# Altium schematic sheet SAMC21N_Xplained_Pro_EDBG.SchDoc: Embedded Debugger (EDBG)
size A3; Organization: Microchip India; DocumentNumber: A09-2682; Revision: 4; SheetNumber: 5; SheetTotal: 9; CheckedBy: M.S.K; DrawnBy: Microchip India; PageSetup: Record=PageOptions|CenterHorizontal=True|CenterVertical=True|PrintScale=0.71|XCorrection=1.00|YCorrection=1.00|PrintKind=0|BorderSize=5000000|LeftOffset=0|BottomOffset=0|Orientation=2|PaperLength=1000|PaperWidth=1000|Scale=100|PaperSource=15|PrintQuality=600|MediaType=1|DitherType=10|PrintScaleMode=1|PaperKind=A4 (210 x 297 mm)|PaperIndex=9; ProjectTitle: ATSAMC21N-XPRO; PCBNumber: A08-2581; PCBRevision: 2
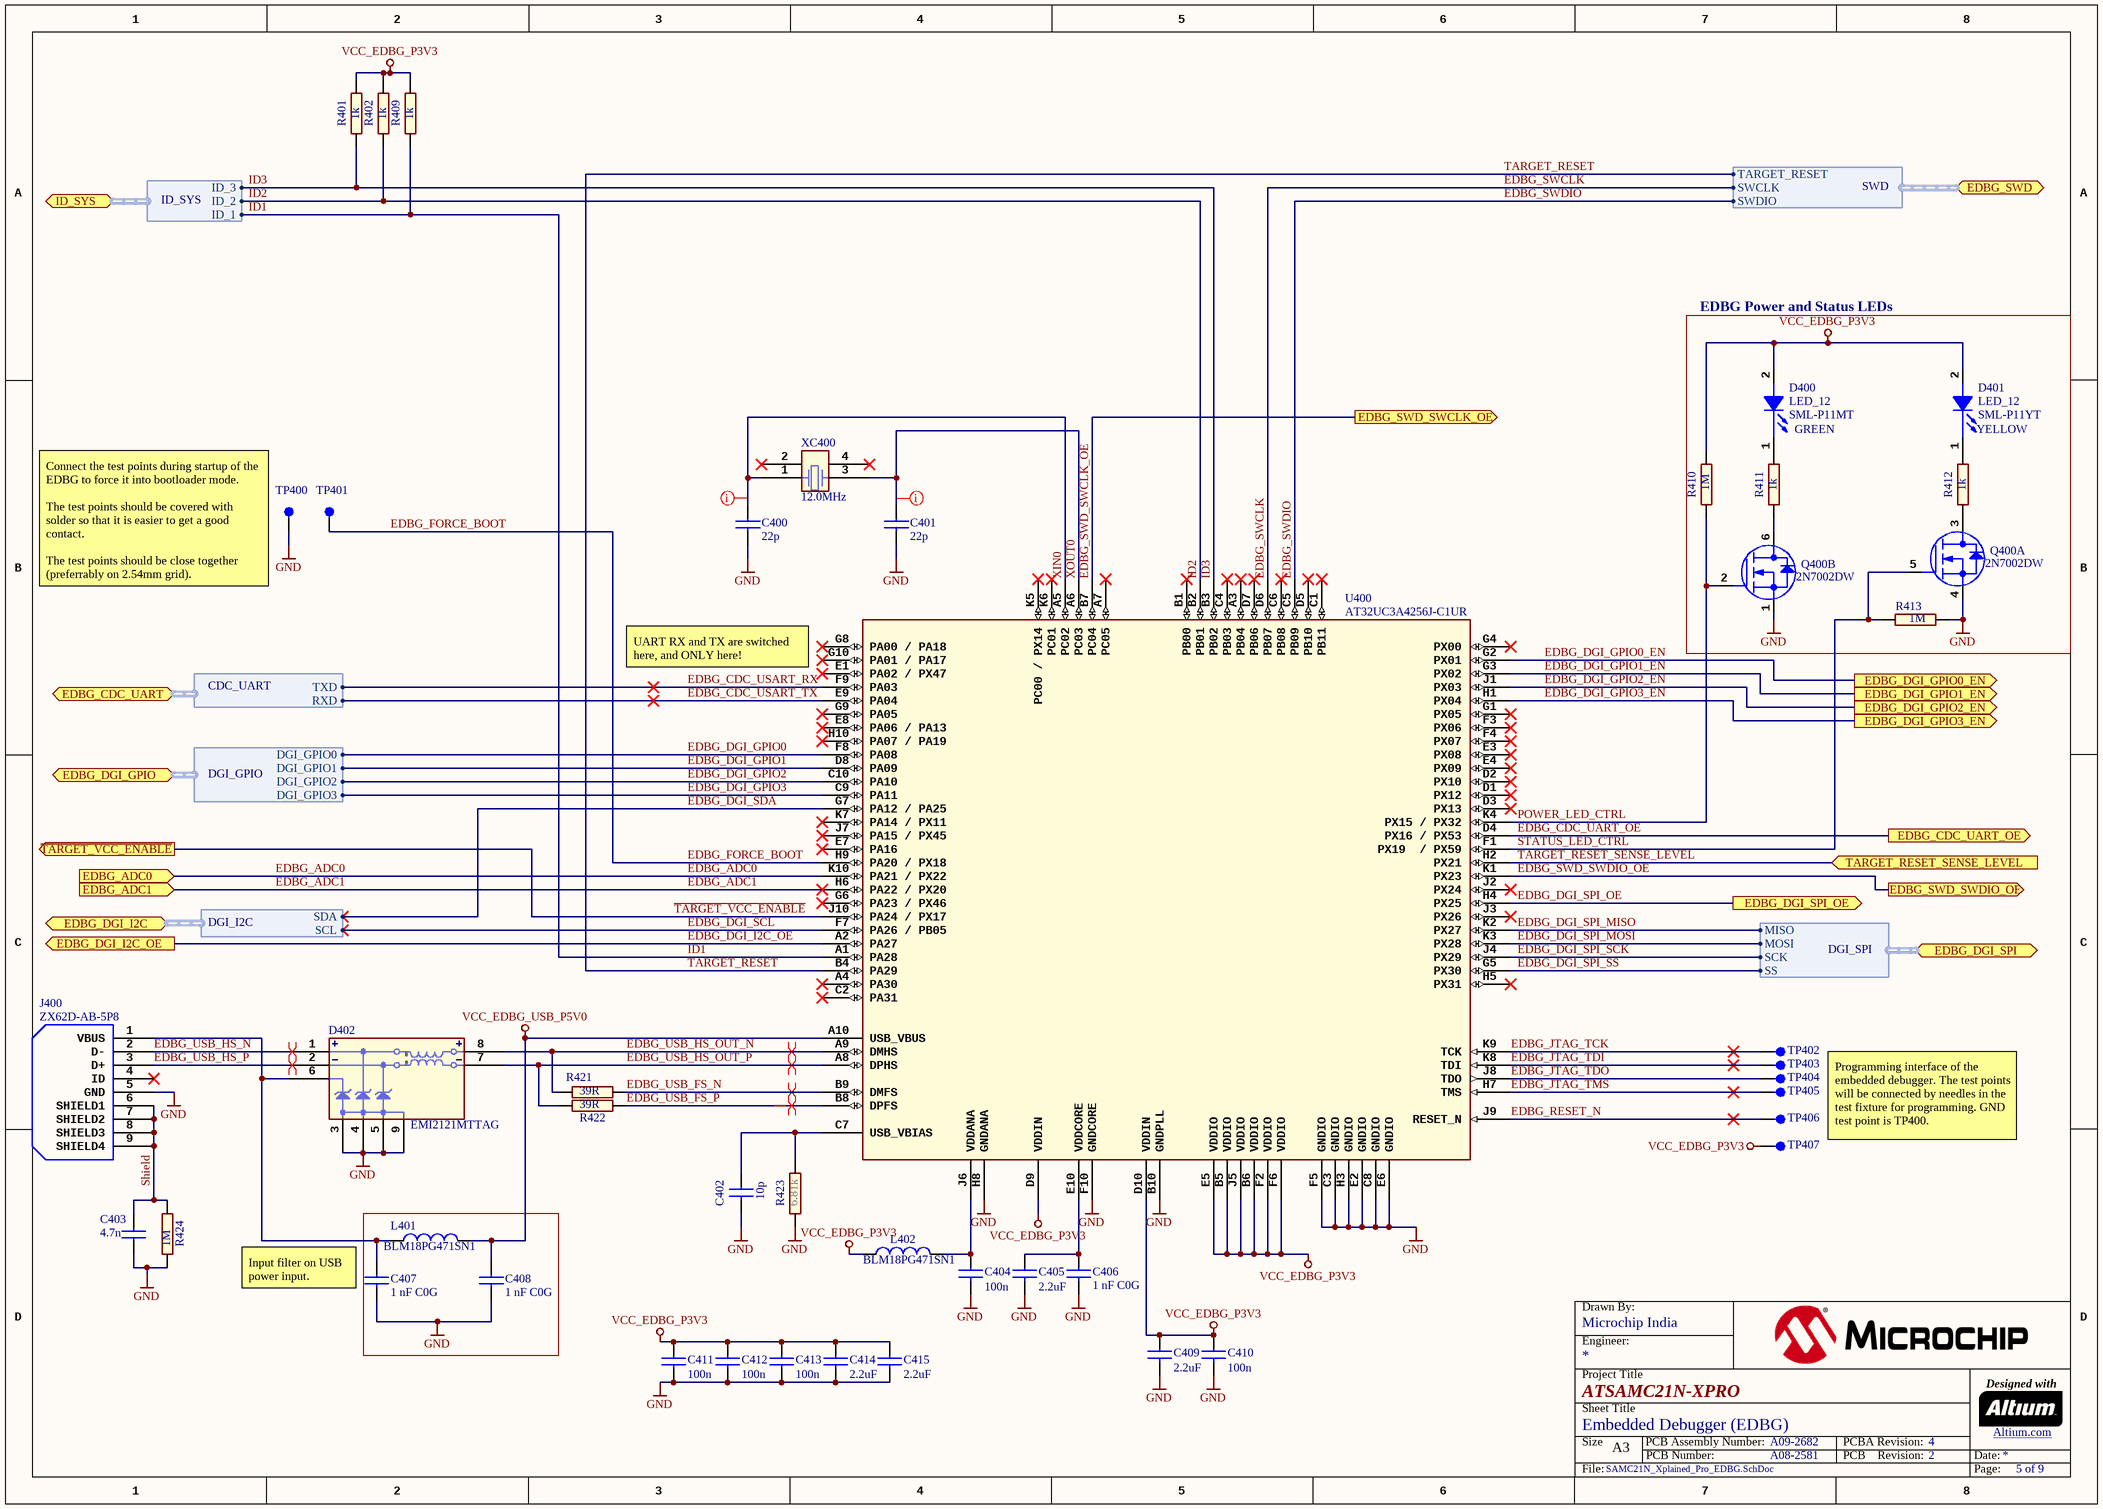
[diagram p0: SAMC21N_Xplained_Pro_EDBG.SchDoc]

## Parts
C400  22p  [AP1-00053]
C401  22p  [AP1-00053]
C402  10p  [AP1-00053]
C403  value 4.7n  [AP1-00053]  (hidden comment: CAP-NONPOL)
C404  100n  [AP1-00053]
C405  value 2.2uF  [AP1-00053]  (hidden comment: Farnell no: 1288200)
C406  1 nF C0G  [AP1-00053]
C407  1 nF C0G  [AP1-00053]
C408  1 nF C0G  [AP1-00053]
C409  value 2.2uF  [AP1-00053]  (hidden comment: Farnell no: 1288200)
C410  100n  [AP1-00053]
C411  100n  [AP1-00053]
C412  100n  [AP1-00053]
C413  100n  [AP1-00053]
C414  value 2.2uF  [AP1-00053]  (hidden comment: Farnell no: 1288200)
C415  value 2.2uF  [AP1-00053]  (hidden comment: Farnell no: 1288200)
D400  LED_12  value SML-P11MT  [AP4-00160]
D401  LED_12  value SML-P11YT  [AP4-00160]
D402  value EMI2121MTTAG  [AP4-00159]  (hidden comment: WDFN8)
J400  value ZX62D-AB-5P8  [AP8-00852]  (hidden comment: 2,000 pieces per reel)
L401  BLM18PG471SN1  [AP3-00005]
L402  BLM18PG471SN1  [AP3-00005]
Q400  value 2N7002DW  [AP5-00001]  (hidden comment: Same as 2N7002 but with two MOSFETs in one package)  (parts A,B of 2)
R401  value 1k  [AP2-00000]  (hidden comment: R2)
R402  value 1k  [AP2-00000]  (hidden comment: R2)
R409  value 1k  [AP2-00000]  (hidden comment: R2)
R410  value 1M  [AP2-00000]  (hidden comment: R2)
R411  value 1k  [AP2-00000]  (hidden comment: R2)
R412  value 1k  [AP2-00000]  (hidden comment: R2)
R413  value 1M  [AP2-00000]  (hidden comment: R2)
R421  value 39R  [AP2-00011]  (hidden comment: R2)
R422  value 39R  [AP2-00011]  (hidden comment: R2)
R423  value 6.81k  [AP2-00011]  (hidden comment: R2)
R424  value 1M  [AP2-00011]  (hidden comment: R2)
TP400  TESTPAD  [AP8-00010]  (value not drawn)  (no BOM)
TP401  TESTPAD  [AP8-00010]  (value not drawn)  (no BOM)
TP402  TESTPAD  [AP8-00010]  (value not drawn)  (no BOM)
TP403  TESTPAD  [AP8-00010]  (value not drawn)  (no BOM)
TP404  TESTPAD  [AP8-00010]  (value not drawn)  (no BOM)
TP405  TESTPAD  [AP8-00010]  (value not drawn)  (no BOM)
TP406  TESTPAD  [AP8-00010]  (value not drawn)  (no BOM)
TP407  TESTPAD  [AP8-00010]  (value not drawn)  (no BOM)
U400  value AT32UC3A4256J-C1UR  [AP6-00206]  (hidden comment: 100 ball VFBGA)
XC400  12.0MHz  [AP7-00039]

## Blocks framed on the sheet
EDBG Power and Status LEDs: D400 D401 Q400 R410-R413

## Ports
EDBG_ADC0 (in), EDBG_ADC1 (in), EDBG_CDC_UART (harness CDC_UART), EDBG_CDC_UART_OE (out), EDBG_DGI_GPIO0_EN (out), EDBG_DGI_GPIO1_EN (out), EDBG_DGI_GPIO2_EN (out), EDBG_DGI_GPIO3_EN (out), EDBG_DGI_GPIO (harness DGI_GPIO), EDBG_DGI_I2C (harness DGI_I2C), EDBG_DGI_I2C_OE (out), EDBG_DGI_SPI (harness DGI_SPI), EDBG_DGI_SPI_OE (out), EDBG_SWD (harness SWD), EDBG_SWD_SWCLK_OE (out), EDBG_SWD_SWDIO_OE (out), ID_SYS (harness ID_SYS), TARGET_RESET_SENSE_LEVEL (in), ~{TARGET_VCC_ENABLE} (out)

## Harnesses
CDC_UART: TXD, RXD
DGI_SPI: MISO, MOSI, SCK, SS
DGI_GPIO: DGI_GPIO0, DGI_GPIO1, DGI_GPIO2, DGI_GPIO3
ID_SYS: ID_1, ID_2, ID_3
SWD: SWCLK, SWDIO, TARGET_RESET
DGI_I2C: SCL, SDA

## Nets
GND: C400.2 C401.2 C402.2 C403.1 C404.2 C405.2 C406.2 C407.2 C408.2 C409.2 C410.2 C411.2 C412.2 C413.2 C414.2 C415.2 D402.3(GND) D402.4(GND) D402.5(GND) D402.9(GND) J400.5(GND) Q400.1(S2) Q400.4(S1) R413.1 R423.1 R424.1 TP400.1 U400.B10(GNDPLL) U400.C3(GNDIO) U400.C8(GNDIO) U400.E2(GNDIO) U400.E6(GNDIO) U400.F5(GNDIO) U400.F10(GNDCORE) U400.H3(GNDIO) U400.H8(GNDANA)
VCC_EDBG_P3V3: C409.1 C410.1 C411.1 C412.1 C413.1 C414.1 C415.1 D400.2(ANODE) D401.2(ANODE) L402.1 R401.2 R402.2 R409.2 R410.2 TP407.1 U400.B5(VDDIO) U400.B6(VDDIO) U400.D9(VDDIN) U400.D10(VDDIN) U400.E5(VDDIO) U400.F2(VDDIO) U400.F6(VDDIO) U400.J5(VDDIO)
VCC_EDBG_USB_P5V0: C408.1 L401.2 U400.A10(USB_VBUS)
EDBG_ADC0: U400.K10(PA21_/_PX22) ; port EDBG_ADC0
EDBG_ADC1: U400.H6(PA22_/_PX20) ; port EDBG_ADC1
EDBG_CDC_UART_OE: U400.D4(PX16_/_PX53) ; port EDBG_CDC_UART_OE
EDBG_CDC_USART_RX: U400.F9(PA03) ; port EDBG_CDC_UART.TXD
EDBG_CDC_USART_TX: U400.E9(PA04) ; port EDBG_CDC_UART.RXD
EDBG_DGI_GPIO0: U400.F8(PA08) ; port EDBG_DGI_GPIO.DGI_GPIO0
EDBG_DGI_GPIO0_EN: U400.G2(PX01) ; port EDBG_DGI_GPIO0_EN
EDBG_DGI_GPIO1: U400.D8(PA09) ; port EDBG_DGI_GPIO.DGI_GPIO1
EDBG_DGI_GPIO1_EN: U400.G3(PX02) ; port EDBG_DGI_GPIO1_EN
EDBG_DGI_GPIO2: U400.C10(PA10) ; port EDBG_DGI_GPIO.DGI_GPIO2
EDBG_DGI_GPIO2_EN: U400.J1(PX03) ; port EDBG_DGI_GPIO2_EN
EDBG_DGI_GPIO3: U400.C9(PA11) ; port EDBG_DGI_GPIO.DGI_GPIO3
EDBG_DGI_GPIO3_EN: U400.H1(PX04) ; port EDBG_DGI_GPIO3_EN
EDBG_DGI_I2C_OE: U400.A2(PA27) ; port EDBG_DGI_I2C_OE
EDBG_DGI_SCL: U400.F7(PA26_/_PB05) ; port EDBG_DGI_I2C.SCL
EDBG_DGI_SDA: U400.G7(PA12_/_PA25) ; port EDBG_DGI_I2C.SDA
EDBG_DGI_SPI_MISO: U400.K2(PX27) ; port EDBG_DGI_SPI.MISO
EDBG_DGI_SPI_MOSI: U400.K3(PX28) ; port EDBG_DGI_SPI.MOSI
EDBG_DGI_SPI_OE: U400.H4(PX25) ; port EDBG_DGI_SPI_OE
EDBG_DGI_SPI_SCK: U400.J4(PX29) ; port EDBG_DGI_SPI.SCK
EDBG_DGI_SPI_SS: U400.G5(PX30) ; port EDBG_DGI_SPI.SS
EDBG_FORCE_BOOT: TP401.1 U400.H9(PA20_/_PX18)
EDBG_JTAG_TCK: TP402.1 U400.K9(TCK)
EDBG_JTAG_TDI: TP403.1 U400.K8(TDI)
EDBG_JTAG_TDO: TP404.1 U400.J8(TDO)
EDBG_JTAG_TMS: TP405.1 U400.H7(TMS)
EDBG_RESET_N: TP406.1 U400.J9(RESET_N)
EDBG_SWCLK: U400.D6(PB07) ; port EDBG_SWD.SWCLK
EDBG_SWD_SWCLK_OE: U400.B7(PC04) ; port EDBG_SWD_SWCLK_OE
EDBG_SWD_SWDIO_OE: U400.K1(PX23) ; port EDBG_SWD_SWDIO_OE
EDBG_SWDIO: U400.C5(PB09) ; port EDBG_SWD.SWDIO
EDBG_USB_FS_N: R421.2 U400.B9(DMFS)
EDBG_USB_FS_P: R422.2 U400.B8(DPFS)
EDBG_USB_HS_N: D402.1(DIFF1_EXT) J400.2(D-)
EDBG_USB_HS_OUT_N: D402.8(DIFF1_INT) R421.1 U400.A9(DMHS)
EDBG_USB_HS_OUT_P: D402.7(DIFF2_INT) R422.1 U400.A8(DPHS)
EDBG_USB_HS_P: D402.2(DIFF2_EXT) J400.3(D+)
ID1: R409.1 U400.A1(PA28) ; port ID_SYS.ID_1
ID2: R402.1 U400.B2(PB01) ; port ID_SYS.ID_2
ID3: R401.1 U400.B3(PB02) ; port ID_SYS.ID_3
POWER_LED_CTRL: Q400.2(G2) R410.1 U400.K4(PX15_/_PX32)
Shield: C403.2 J400.6(SHIELD1) J400.7(SHIELD2) J400.8(SHIELD3) J400.9(SHIELD4) R424.2
STATUS_LED_CTRL: Q400.5(G1) R413.2 U400.F1(PX19__/_PX59)
~{TARGET_VCC_ENABLE}: U400.J10(PA24_/_PX17) ; port ~{TARGET_VCC_ENABLE}
TARGET_RESET: U400.B4(PA29) ; port EDBG_SWD.TARGET_RESET
TARGET_RESET_SENSE_LEVEL: U400.H2(PX21) ; port TARGET_RESET_SENSE_LEVEL
XIN0: C400.1 U400.A5(PC02) XC400.1
XOUT0: C401.1 U400.A6(PC03) XC400.3
NetC402_1: C402.1 R423.2 U400.C7(USB_VBIAS)
NetC404_1: C404.1 L402.2 U400.J6(VDDANA)
NetC405_1: C405.1 C406.1 U400.E10(VDDCORE)
NetC407_1: C407.1 D402.6(VBUS) J400.1(VBUS) L401.1
NetD400_1: D400.1(CATHODE) R411.2
NetD401_1: D401.1(CATHODE) R412.2
NetQ400_3: Q400.3(D1) R412.1
NetQ400_6: Q400.6(D2) R411.1

Not connected (* = marked no-connect by the designer): J400 4(ID)*; U400 A3(PB04)* A4(PA30)* A7(PC05)* B1(PB00)* C1(PB11)* C2(PA31)* C4(PB03)* C6(PB08)* D1(PX12)* D2(PX10)* D3(PX13)* D5(PB10)* D7(PB06)* E1(PA02_/_PX47)* E3(PX08)* E4(PX09)* E7(PA16)* E8(PA06_/_PA13)* F3(PX06)* F4(PX07)* G1(PX05)* G4(PX00)* G6(PA23_/_PX46)* G8(PA00_/_PA18)* G9(PA05)* G10(PA01_/_PA17)* H5(PX31)* H10(PA07_/_PA19)* J2(PX24)* J3(PX26)* J7(PA15_/_PX45)* K5(PC00_/_PX14)* K6(PC01)* K7(PA14_/_PX11)*; XC400 2* 4*

## Layout directives
differential pair; rule Assembly Testpoint Usage [Testpoint - Not Allowed    Multiple - Not Allowed]: EDBG_USB_FS_N, EDBG_USB_FS_P, EDBG_USB_HS_N, EDBG_USB_HS_OUT_N, EDBG_USB_HS_OUT_P, EDBG_USB_HS_P
rule Assembly Testpoint Usage [Testpoint - Not Allowed    Multiple - Not Allowed]: XIN0, XOUT0

## Notes on the sheet
- GREEN
- (near D401) YELLOW
- (near TP400) Connect the test points during startup of the EDBG to force it into bootloader mode.
  The test points should be covered with solder so that it is easier to get a good contact.
  The test points should be close together (preferrably on 2.54mm grid).
- UART RX and TX are switched here, and ONLY here!
- Programming interface of the embedded debugger. The test points will be connected by needles in the test fixture for programming. GND test point is TP400.
- (near C407) Input filter on USB power input.
- Drawn By:
- Project Title
- Engineer:
- Designed with
- Sheet Title
- Size
- A3
- PCB Number:
- PCB Assembly Number:
- PCBA Revision:
- PCB    Revision:
- Date:
- Altium.com <http://go.altium.com/MicrochipLandingPage_Evaluation.html>
- File:
- Page:

## Library data of the parts
C400 C401 = A01-0019: Ceramic capacitor, SMD 0402, NP0, 50V, +/-5%; PartGroup: Capacitors,Ceramic,SMD 0402; TemperatureRange: -55 - +125 deg C; ComponentStatus: 'Active (verified)'; Status: Active; Verified by: Lars Helge Mo; Verified date: 2005-12-15; AN: A01-0019; Value: 22p; Tolerance: 50V, +/-5%; Height: 0,550000011920929; FootprintStatus: 'Active (Verified)'
C402 = A01-0015: Ceramic capacitor, SMD 0402, NP0, 50V, +/-5%; PartGroup: Capacitors,Ceramic,SMD 0402; TemperatureRange: -55 - +125 deg C; ComponentStatus: 'Active (verified)'; Status: Active; Verified by: Lars Helge Mo; Verified date: 2005-12-15; AN: A01-0015; Value: 10p; Tolerance: 50V, +/-5%; Height: 0,550000011920929; FootprintStatus: 'Active (Verified)'
C403 = A01-0046: Ceramic capacitor, SMD 0402, X7R, 25V, +/-10%; PartGroup: Capacitors,Ceramic,SMD 0402; TemperatureRange: -55 - +125 deg C; ComponentStatus: 'Active (verified)'; Status: Active; Verified by: Lars Helge Mo; Verified date: 2005-12-15; AN: A01-0046; Tolerance: 25V, +/-10%; Height: 0.550000011920929; FootprintStatus: 'Active (Verified)'
C404 C410-C413 = A01-0246: Ceramic capacitor, SMD 0402, X7R, 16V, +/-10%; PartGroup: Capacitors,Ceramic,SMD 0402; Manufacturer: Kemet; MPN: C0402C104K4RACTU; TemperatureRange: -55 - +125 deg C; ComponentStatus: 'Active (verified)'; Status: Active; Verified by: Lars Helge Mo; Verified date: 2005-12-15; AN: A01-0246; Value: 100n; Tolerance: 16V, +/-10%; Height: 0,5; FootprintStatus: 'Active (Verified)'
C405 C409 C414 C415 = A01-0300: Ceramic capacitor, SMD 0402, X5R, 6.3V, +/-20%; PartGroup: Capacitors,Ceramic,SMD 0402; Manufacturer: Kemet; MPN: C0402C225M9PAC; Tolerance: ±20%; TemperatureRange: -55°C to +85°C; ComponentStatus: 'Active (verified)'; Status: Active; Verified by: Lars Helge Mo; Verified date: 2005-12-15; AN: A01-0300; Height: 0,5; FootprintStatus: 'Active (Verified)'
C406-C408 = A01-0321: Ceramic capacitor, SMD 0402, C0G, 50V, +/-5%; PartGroup: Capacitors,Ceramic,SMD 0402; Manufacturer: Murata; MPN: GRM1555C1H102JA01D; Tolerance: 5%; ComponentStatus: 'Active (verified)'; Status: Active; Verified by: Lars Helge Mo; Verified date: 2005-12-15; AN: A01-0321; Value: 1 nF C0G; FootprintStatus: 'Active (Verified)'
D400 = A10-0183: LED, SMD 0402, Green, Wave length=569nm, 2.1mcd @ (1mA, 1.9Vf); PartGroup: Opto,LEDs,SMD; Manufacturer: ROHM; MPN: SML-P11MT-T86; TemperatureRange: -40 to +85; ComponentStatus: 'Active (verified)'; Verified date: 2006-02-17; Verified by: Sveinung Helgeland; Status: Active; AN: A10-0183; Height: 0.200000002980232; FootprintStatus: 'Active (Verified)'
D401 = A10-0182: LED, SMD 0402, Yellow, Wave length=586nm, 7.6mcd @ (1mA, 1.9Vf); PartGroup: Opto,LEDs,SMD; Manufacturer: ROHM; MPN: SML-P11YT-T86; TemperatureRange: -40 to +85; ComponentStatus: 'Active (verified)'; Verified date: 2006-02-17; Verified by: Sveinung Helgeland; Status: Active; AN: A10-0182; Height: 0.200000002980232; FootprintStatus: 'Active (Verified)'
D402 = A04-0195: EMI2121, SZEMI2121 Single Pair Common Mode Filter with ESD Protection; PartGroup: Diodes,Transient suppression; Manufacturer: ON Semiconductor; TemperatureRange: âˆ’40 to +85 Â°C; ComponentStatus: 'Active (verified)'; AN: A04-0195; Height: 0.800000011920929; MPN: EMI2121MTTAG; FootprintStatus: 'Active (Verified)'
J400 = A08-2112: Micro USB AB Connector, Standard SMT + DIP; PartGroup: Mechanical devices,Connectors,USB; ComponentStatus: 'Active (verified)'; Verified date: 2006-05-18; Verified by: Eirik Rasmussen; Status: Active; AN: A08-2112; Height: 2.79999995231628; FootprintStatus: 'New (Not verified)'
L401 L402 = A03-0035: SMD RF inductor 0603. Z=470Ohm (@100MHz), Max R(dc)=0.65Ohm, Max current=1A; PartGroup: Inductors,EMI; Manufacturer: Murata; Tolerance: ±25%; TemperatureRange: -55°C to +125°C; ComponentStatus: 'Active (verified)'; Verified date: 2006-01-30; Verified by: Lars Helge Mo; Status: Active; AN: A03-0035; Value: BLM18PG471SN1; Height: 0,800000011920929; MPN: BLM18PG471SN1; FootprintStatus: 'Active (Verified)'
Q400 = A05-0051: Dual N-Channel MOSFET, 60V, 115mA cont,RDS(ON) < 7.5 Ohm @50mA@5V, SOT-363; PartGroup: Transistors,Small signal FET,SMD; Manufacturer: Fairchild; TemperatureRange: -65 to 150 deg C; ComponentStatus: 'Active (verified)'; Status: New; AN: A05-0051; Height: 1,10000002384186; MPN: 2N7002DW; FootprintStatus: 'Active (Verified)'
R401 R402 R409 = A02-0212: Thick film resistor, SMD 0402, 1/16W, 1%; PartGroup: Resistors,SMD,0402 1%; TemperatureRange: -55 - +125 deg C; ComponentStatus: 'Active (verified)'; Status: Active; Verified by: Lars Helge Mo; Verified date: 2005-12-19; AN: A02-0212; Tolerance: 1 %; Height: 0.349999994039536; FootprintStatus: 'Active (Verified)'
R410 R413 R424 = A02-0284: Thick film resistor, SMD 0402, 1/16W, 1%; PartGroup: Resistors,SMD,0402 1%; Manufacturer: KOA; MPN: RK73H1ETTP1004F; TemperatureRange: -55 - +125 deg C; ComponentStatus: 'Active (verified)'; Status: Active; Verified by: Lars Helge Mo; Verified date: 2005-12-19; AN: A02-0284; Tolerance: 1 %; FootprintStatus: 'Active (Verified)'
  R410 R413: Height: 0.349999994039536
  R424: Height: 0,349999994039536
R411 R412 = A02-0212: Thick film resistor, SMD 0402, 1/16W, 1%; PartGroup: Resistors,SMD,0402 1%; Manufacturer: ASJ; MPN: CR10-1001-FK; TemperatureRange: -55 - +125 deg C; ComponentStatus: 'Active (verified)'; Status: Active; Verified by: Lars Helge Mo; Verified date: 2005-12-19; AN: A02-0212; Tolerance: 1 %; Height: 0.349999994039536; FootprintStatus: 'Active (Verified)'
R421 R422 = A02-0178: Thick film resistor, SMD 0402, 1/16W, 1%; PartGroup: Resistors,SMD,0402 1%; TemperatureRange: -55 - +125 deg C; ComponentStatus: 'Active (verified)'; Status: Active; Verified by: Lars Helge Mo; Verified date: 2005-12-19; AN: A02-0178; Tolerance: 1 %; Height: 0,349999994039536; FootprintStatus: 'Active (Verified)'
R423 = A02-0539: Thick film resistor, SMD 0402, 1/16W, 1%; PartGroup: Resistors,SMD,0402 1%; TemperatureRange: -55 - +125 deg C; ComponentStatus: 'Active (verified)'; Status: Active; Verified by: Lars Helge Mo; Verified date: 2005-12-19; AN: A02-0539; Tolerance: 1%; Height: 0,349999994039536; FootprintStatus: 'Active (Verified)'
TP400-TP407 = A08-0004: Single SMD testpad; PartGroup: Mechanical devices,Connectors,Test points; ComponentStatus: 'Active (verified)'; Status: Active; Verified by: Sveinung Helgeland; Verified date: 2006-02-17; AN: A08-0004; Value: TESTPAD; Height: 0; FootprintStatus: 'Active (Verified)'
U400 = A06-0736: AVR 32-bit RISC MCU; PartGroup: Integrated Circuits,MCU, MPU, DSP,AVR MCU; Manufacturer: ATMEL; TemperatureRange: -40 to +85 deg C; ComponentStatus: 'Active (verified)'; Status: Not verified; AN: A06-0736; Height: 1; MPN: AT32UC3A4256J-C1UR; FootprintStatus: 'Active (Verified)'
XC400 = A07-0042: Fox FQ5032B 12.0MHz SMD crystal 738B-12; PartGroup: Frequency devices,Crystals,SMD; Manufacturer: Fox  Electronics; MPN: FQ5032B-12-C-C-C-200-1; Tolerance: 30PPM; ComponentStatus: 'Active (verified)'; Status: Active; Verified by: Ketil Skjerve; Verified date: 2007-06-15; AN: A07-0042; Value: 12.0MHz; Height: 1,20000004768372; FootprintStatus: 'Active (Verified)'